# Altium schematic sheet BEMF_Sense.SchDoc
size A4
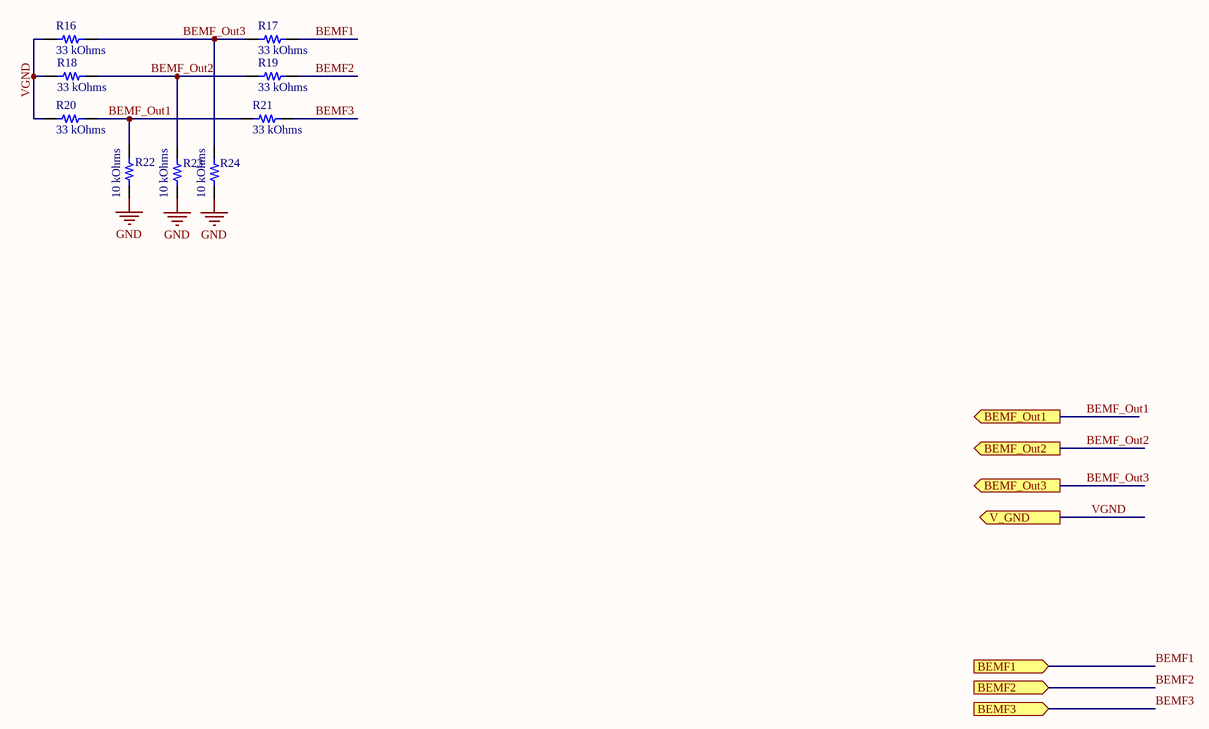
[diagram p0: BEMF_Sense.SchDoc]

## Parts
R16  33 kOhms  [RES 0805_2012]
R17  33 kOhms  [RES 0805_2012]
R18  33 kOhms  [RES 0805_2012]
R19  33 kOhms  [RES 0805_2012]
R20  33 kOhms  [RES 0805_2012]
R21  33 kOhms  [RES 0805_2012]
R22  10 kOhms  [RES 0805_2012]
R23  10 kOhms  [RES 0805_2012]
R24  10 kOhms  [RES 0805_2012]

## Ports
BEMF1 (in), BEMF2 (in), BEMF3 (in), BEMF_Out1 (out), BEMF_Out2 (out), BEMF_Out3 (out), V_GND (out)

## Nets
GND: R22.1 R23.1 R24.1
BEMF1: R17.2 ; port BEMF1
BEMF2: R19.2 ; port BEMF2
BEMF3: R21.2 ; port BEMF3
BEMF_Out1: R20.2 R21.1 R22.2 ; port BEMF_Out1
BEMF_Out2: R18.2 R19.1 R23.2 ; port BEMF_Out2
BEMF_Out3: R16.2 R17.1 R24.2 ; port BEMF_Out3
VGND: R16.1 R18.1 R20.1 ; port V_GND

## Library data of the parts
R16-R21 = CR0805-FX-3302ELF: RES SMD 33K OHM 1% 1/8W 0805; Manufacturer: Bourns Inc.; Power (Watts): 0.125W, 1/8W; Temperature Coefficient: ±100ppm/°C; Part Number: CR0805-FX-3302ELF; Value: 33 kOhms; ComponentLink1Description: Datasheet; ComponentLink1URL: https://www.bourns.com/docs/Product-Datasheets/CHPREZTR.pdf; ComponentLink2Description: DigiKey Link; ComponentLink2URL: http://digikey.com/product-detail/en/bourns-inc/CR0805-FX-3302ELF/CR0805-FX-3302ELFCT-ND/4247928; Composition: Thick Film; Device Package: 0805 (2012 Metric); Features: Moisture Resistant; Height - Seated (Max): 0.024" (0.60mm); LastUpdated: 2.9.2020 01:14:29; Lifecycle Status: Active; Minimum Order: 1; Number of Terminations: 2; Operating Temperature: -55°C ~ 155°C; Package / Case: 0805 (2012 Metric); Packaging: TapeAndReel; PartId: 48969; Part Status: Active; Price: 0.01; Resistance: 33 kOhms; Series: CR0805; Size / Dimension: 0.079" L x 0.049" W (2.00mm x 1.25mm); Supplier 1: DigiKey; Supplier Part Number 1: CR0805-FX-3302ELFCT-ND; Supplier Device Package: 0805; Tolerance: ±1%
R22-R24 = RN73R2ATTD1002F25: RES 10K OHM 1% 1/8W 0805; Manufacturer: KOA Speer Electronics, Inc.; Power (Watts): 0.125W, 1/8W; Temperature Coefficient: ±25ppm/°C; Part Number: RN73R2ATTD1002F25; Value: 10 kOhms; ComponentLink1Description: Datasheet; ComponentLink1URL: //media.digikey.com/pdf/Data%20Sheets/KOA%20Speer/RN73R_Type_DS.pdf; ComponentLink2Description: DigiKey Link; ComponentLink2URL: http://digikey.com/product-detail/en/koa-speer-electronics-inc/RN73R2ATTD1002F25/2019-RN73R2ATTD1002F25CT-ND/11476953; Composition: Metal Film; Device Package: 0805 (2012 Metric); Features: Moisture Resistant; LastUpdated: 2.9.2020 01:14:23; Lifecycle Status: Active; Minimum Order: 1; Number of Terminations: 2; Operating Temperature: -55°C ~ 155°C; Package / Case: 0805 (2012 Metric); Packaging: TapeAndReel; PartId: 50100; Part Status: Active; Price: 0.06; Resistance: 10 kOhms; Series: RN73R; Supplier 1: DigiKey; Supplier Part Number 1: 2019-RN73R2ATTD1002F25CT-ND; Supplier Device Package: 0805; Tolerance: ±1%